# EAGLE design Climber (EAGLE 9.5.2)
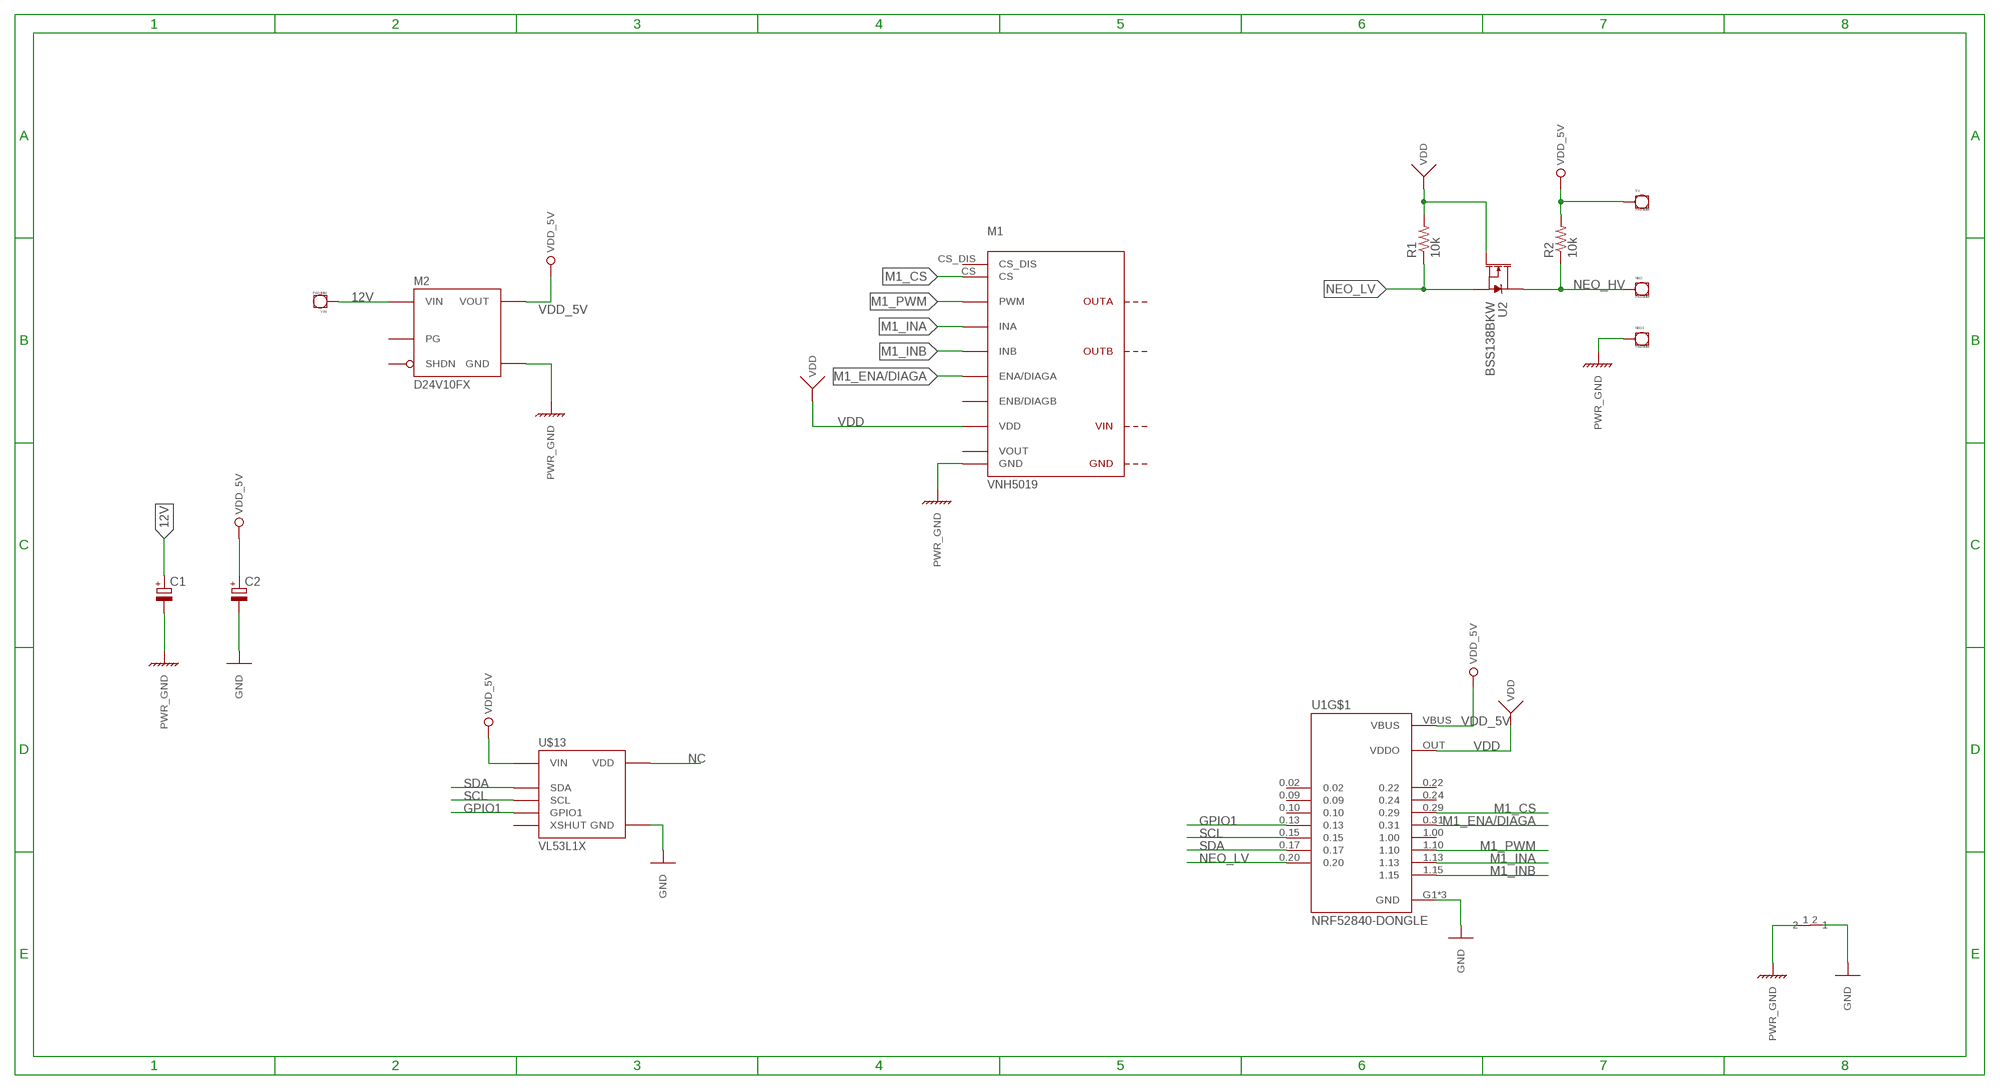
[diagram p0: schematic, sheet 1]

## Parts
5V  PAD3MM  [PAD_3]
C1  CPOL-EUE5-4  [E5-4]
C2  CPOL-EUE5-4  [E5-4]
M1  VNH5019  [VNH5019]
M2  D24V10FX  [D24V10FX]
NEO  PAD3MM  [PAD_3]
NEO1  PAD3MM  [PAD_3]
R1  10k  R-US_R0603  [R0603]
R2  10k  R-US_R0603  [R0603]
U1  NRF52840-DONGLE  [MODULE_NRF52840-DONGLE]
U2  BSS138BKW  [SOT65P210X110-3N]
U$10  NET_CONN  [NET_CONN]
U$13  VL53L1X  [VL53L1X]
VIN  PAD3MM  [PAD_3]

## Nets
12V [Power]: C1.+ M2.VIN VIN.P$1
GND [Power]: C2.- U1.G1(GND) U1.G2(GND) U1.G3(GND) U$10.2 U$13.GND
GPIO1: U1.0.13 U$13.GPIO1
M1_CS: M1.CS U1.0.29
M1_ENA/DIAGA: M1.ENA(ENA/DIAGA) U1.0.31
M1_INA: M1.INA U1.1.13
M1_INB: M1.INB U1.1.15
M1_PWM: M1.PWM U1.1.10
NC: U$13.VDD
NEO_HV: NEO.P$1 R2.1 U2.3(D)
NEO_LV: R1.1 U1.0.20 U2.2(S)
PWR_GND [Power]: C1.- M1.GND@0(GND) M1.GND@1(GND) M2.GND NEO1.P$1 U$10.1 ; supply symbol labelled GNDIN
SCL: U1.0.15 U$13.SCL
SDA: U1.0.17 U$13.SDA
VDD [Power]: M1.VDD R1.2 U1.OUT(VDDO) U2.1(G) ; supply symbol labelled 5V
VDD_5V [Power]: 5V.P$1 C2.+ M2.VOUT R2.2 U1.VBUS U$13.VIN
Unconnected: M1.CS_DIS M1.ENB(ENB/DIAGB) M2.!SHDN(SHDN) M2.PG U1.0.02 U1.0.09 U1.0.10 U1.0.22 U1.0.24 U1.1.00 U1.SWDCLK U1.SWDIO U$13.XSHUT

## Power pins joined to a net without a drawn wire
VOUT: M1.VOUT

## Library data of the parts
5V NEO NEO1 VIN = Exposed_pad:PAD: Thing used to expose a pad
C1 C2 = resistor:CPOL-EU: POLARIZED CAPACITOR, European symbol
M1 = Pololu:VNH5019
M2 = Pololu:D24V10FX
R1 R2 = resistor:R-US_: RESISTOR, American symbol
U1 = NRF52840-DONGLE:NRF52840-DONGLE: NRF52840 Bluetooth-5/Thread/802.15.4/ANT/2.4GHz Multiprotocol SoC USB Development Dongle; AVAILABILITY: Unavailable; DESCRIPTION: - Transceiver; Bluetooth® 5 For Use With nRF52840; MF: Nordic Semiconductor; MP: NRF52840-DONGLE; PACKAGE: None; PRICE: None
U2 = BSS138:BSS138BKW: N-channel Trench MOSFET; MPN: BSS138BKW; OC_FARNELL: 2053836; OC_NEWARK: 61T7488; PACKAGE: SOT-23-3; SUPPLIER: NXP
U$10 = NET_CONN:NET_CONN: Net connector
U$13 = Pololu:VL53L1X

## Net classes
0 default: width 0.203 mm, drill 0.762 mm, clearance 0.203 mm
1 Power: width 0.635 mm, drill 1.27 mm, clearance 0.254 mm to class 0, clearance 0.508 mm

## Board
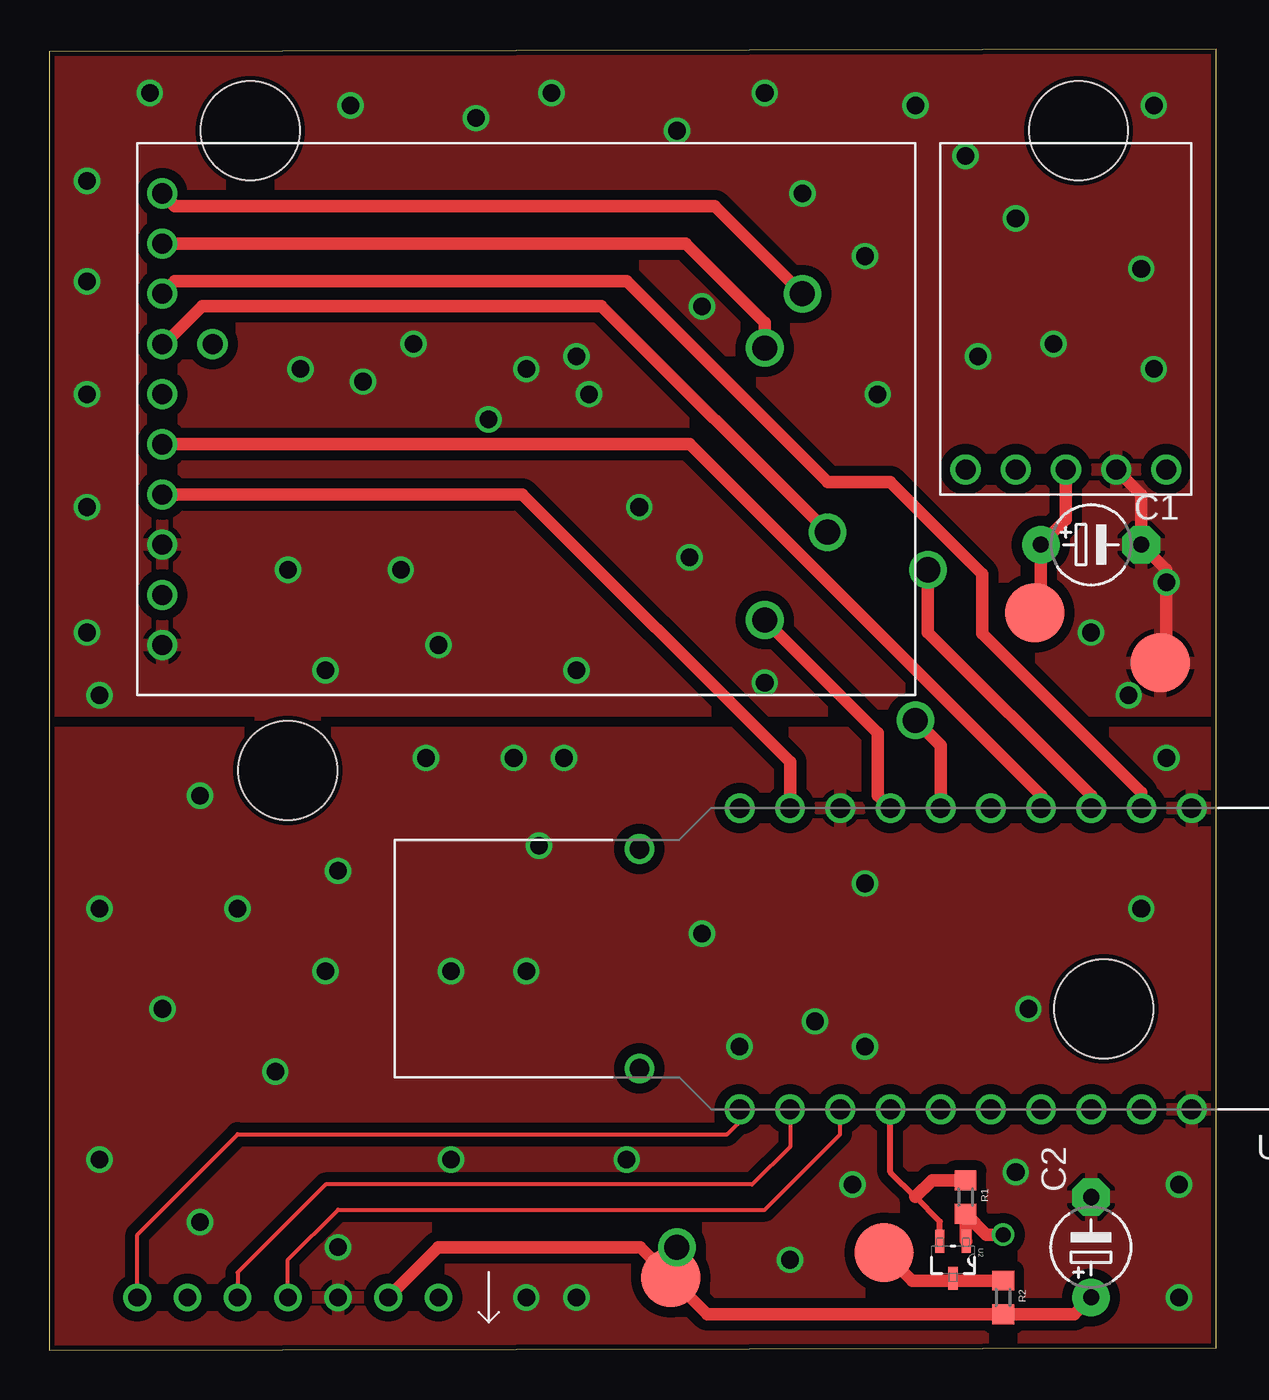
[diagram p1: board, top side]
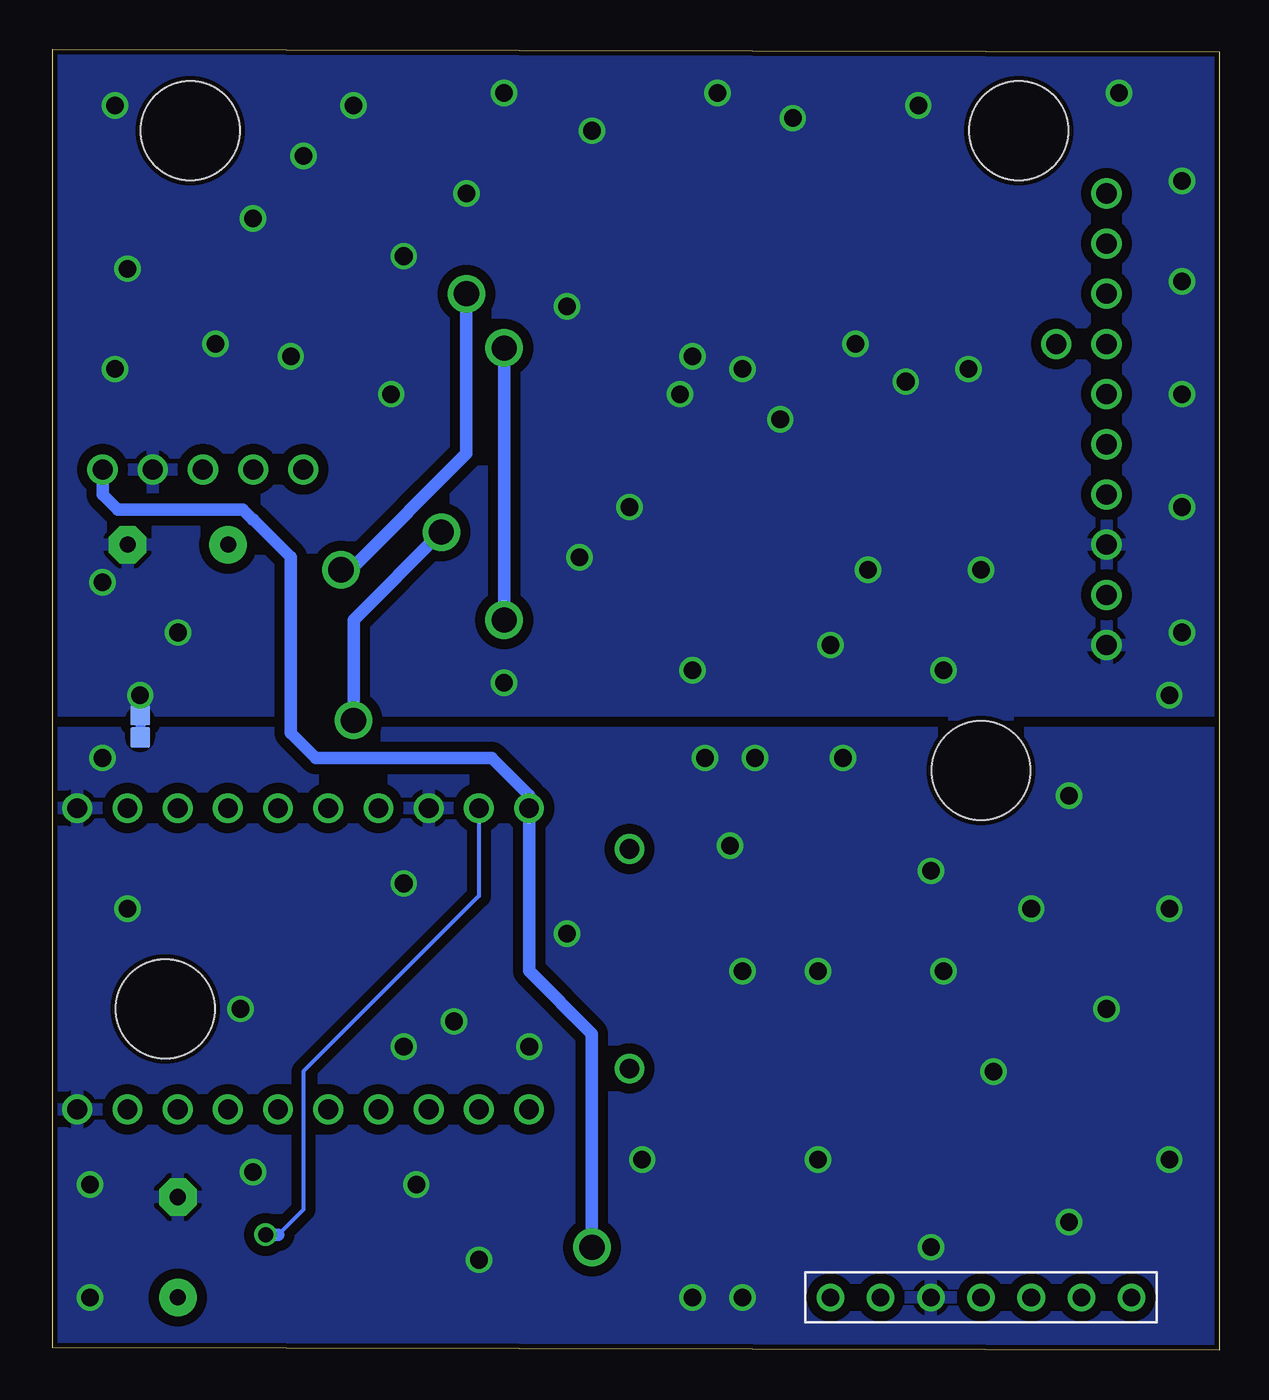
[diagram p2: board, bottom side, seen from below]

Size 59.04 x 65.84 mm. Coordinates in mm from the lower left corner, seen from the top.
Outline: 0,0 59.04,0.13 59.04,65.84 0,65.71 0,0
Copper layers (1*16): Top 0.035mm / dielectric 1.5mm / Bottom 0.035mm
Design rules "SeeedStudio_2layer_DRU_no_angle_20140221": minimum track width 6mil, minimum drill 12mil, track to track 6mil, track to pad 6mil, pad to pad 6mil, via to via 6mil, smd to smd 0mil, copper to edge 10mil, drill to drill 10mil, minimum pad ring 10mil, minimum via ring 6mil, stop-mask expansion 2mil, vias tented up to drill 100mil, thermal gap 10mil
Holes 5 mm at 12.06,29.34 52.07,61.72 10.16,61.72 53.34,17.27

### Footprints (pad centres in the part's own frame; a part is rotated, then mirrored left to right if it is on the bottom)
PAD_3 = smd 3 x 3: P$1 0.325,1
E5-4 = drill 0.813 pad 1.905: + -2.54,0 | drill 0.813 pad 1.905 octagon: - 2.54,0
VNH5019 = drill 1.016: CS 15.24,0; CS_DIS 15.24,-2.54; ENA 20.32,0; ENB 12.7,0; GND@0 5.08,0; GND@1 0,0; INA 22.86,0; INB 10.16,0; PWM 17.78,0; VDD 7.62,0; VOUT 2.54,0
D24V10FX = drill 1.016: !SHDN 7.62,0; GND 2.54,0; PG 10.16,0; VIN 5.08,0; VOUT 0,0
R0603 = smd 1 x 1.1: 1 -0.85,0; 2 0.85,0
MODULE_NRF52840-DONGLE = drill 1: 0.02 10.152,-15.24; 0.09 5.072,0; 0.10 2.532,0; 0.13 22.852,0; 0.15 20.312,0; 0.17 17.772,0; 0.20 15.232,0; 0.22 12.692,0; 0.24 10.152,0; 0.29 12.692,-15.24; 0.31 15.232,-15.24; 1.00 7.612,0; 1.10 2.532,-15.24; 1.13 5.072,-15.24; 1.15 7.612,-15.24; G1 -0.008,0; G2 -0.008,-15.24; G3 17.772,-15.24; OUT 20.312,-15.24; SWDCLK 27.932,-13.18; SWDIO 27.932,-2.06; VBUS 22.852,-15.24
SOT65P210X110-3N = smd 1.168 x 0.457: 1 -0.94,0.66; 2 -0.94,-0.66; 3 0.94,0
NET_CONN = smd 1 x 1: 1 0.381,0; 2 1.5,0
VL53L1X = drill 0.889: GND 0,-5.08; GPIO1 0,-15.24; SCL 0,-10.16; SDA 0,-7.62; VDD 0,0; VIN 0,-2.54; XSHUT 0,-12.7

### Placement (x,y rotation side)
5V  31.11,2.67 0 top
C1  52.71,40.77 0 top
C2  52.71,5.21 90 top
M1  5.71,35.69 90 top
M2  56.52,44.58 180 top
NEO  41.91,3.94 0 top
NEO1  55.88,33.78 0 top
R1  46.36,7.75 270 top
R2  48.26,2.67 270 top
U1  57.79,12.19 180 top
U2  45.72,4.57 270 top
U$10  54.61,32.51 270 bottom
U$13  19.68,2.67 270 top
VIN  49.53,36.32 0 top

### Tracks (layer width: path | path; a pad name or v marks a point on that pad's centre or on a via)
12V
  Top 0.635: M2.VIN 51.44,42.04 C1.+ 50.16,37.63 VIN.P$1
GND  (via drill 0.89)
  other vias: 2.54,22.35 5.71,17.27 14.61,24.26 24.13,19.18 24.76,25.53 33.02,21.08 2.54,9.65 26.67,2.67 20.32,9.65 29.21,9.65 40.64,8.38 14.61,5.21 7.62,6.48 19.05,29.97 23.49,29.97 26.04,29.97 20.32,19.18 13.97,19.18 11.43,14.1 9.53,22.35 56.52,29.97 41.27,23.62 49.53,17.27 55.25,22.35 38.73,16.64 37.47,4.57 24.13,2.67 34.93,15.37 41.27,15.37 57.15,2.67 57.15,8.38 48.9,9.02 7.62,28.07
  pour Bottom: -5.71,26.8 -1.27,31.24 60.96,31.24 63.5,28.7 63.5,-0.51 62.23,-1.78 -3.81,-1.78 -5.71,0.13
  pour Top: -5.08,26.8 -0.64,31.24 61.59,31.24 64.13,28.7 64.13,-0.51 62.87,-1.78 -3.17,-1.78 -5.08,0.13
GPIO1
  Top 0.203: U$13.GPIO1 4.45,5.84 9.53,10.92 34.29,10.92 34.93,11.57 U1.0.13
M1_CS  (via drill 1.27)
  Top 0.635: M1.CS 5.81,50.93 7.72,52.84 27.93,52.84 v39.37,41.4 | U1.0.29 45.09,30.6 v43.82,31.88
  Bottom 0.635: v39.37,41.4 43.82,36.96 v43.82,31.88
M1_ENA/DIAGA  (via drill 1.27)
  Top 0.635: M1.ENA 32.21,56.01 36.2,52.02 v36.2,50.72 | U1.0.31 41.92,28.07 41.92,31.23 v36.2,36.96
  Bottom 0.635: v36.2,50.72 v36.2,36.96
M1_INA  (via drill 1.27)
  Top 0.635: U1.1.13 52.71,28.07 44.45,36.33 v44.45,39.5 | v38.1,53.47 33.66,57.91 6.35,57.91 M1.INA
  Bottom 0.635: v44.45,39.5 43.97,39.5 38.1,45.37 v38.1,53.47
M1_INB
  Top 0.635: M1.INB 32.39,45.85 50.17,28.07 U1.1.15
M1_PWM
  Top 0.635: M1.PWM 6.35,54.1 29.21,54.1 39.37,43.94 42.55,43.94 47.19,39.29 47.19,36.27 55.25,28.21 U1.1.10
NEO_HV
  Top 0.635: R2.1 45.84,3.52 | 45.84,3.52 U2.3 | NEO.P$1 43.66,3.52 45.84,3.52
NEO_LV
  Top 0.305: U2.2 45.06,6.5 43.82,7.75 42.55,9.01 U1.0.20
  Top 0.635: R1.1 44.66,8.6 43.82,7.75
PWR_GND  (via drill 0.89)
  Top 0.635: M2.GND 55.25,43.31 C1.- 56.52,39.5 v56.52,38.86 56.52,35.09 NEO1.P$1
  Bottom 0.635: U$10.1 v54.61,33.15
  other vias: 55.25,54.74 48.9,57.28 55.88,49.66 50.8,50.93 38.1,58.55 41.91,48.39 32.39,40.13 36.2,33.78 18.41,50.93 22.22,47.12 24.13,49.66 27.3,48.39 43.82,62.99 5.08,63.63 1.91,59.18 1.91,54.1 1.91,48.39 1.91,42.67 15.24,62.99 21.59,62.36 25.4,63.63 31.75,61.72 36.2,63.63 46.36,60.45 55.88,62.99 46.99,50.29 52.71,36.32 26.67,50.29 41.27,55.37 29.84,42.67 17.78,39.5 19.68,35.69 12.06,39.5 13.97,34.42 1.91,36.32 2.54,33.15 12.7,49.66 26.67,34.42 15.88,49.02 33.02,52.83
  pour Bottom (rank 2): -4.45,68.71 64.13,68.71 66.67,66.17 66.67,-1.14 64.13,-3.68 -4.45,-3.68 -6.98,-1.14 -6.98,66.17
  pour Top (rank 2): -1.91,67.44 66.67,67.44 69.21,64.9 69.21,-2.41 66.67,-4.95 -1.91,-4.95 -4.45,-2.41 -4.45,64.9
SCL
  Top 0.203: U1.0.15 37.47,10.3 35.56,8.38 13.97,8.38 9.53,3.94 U$13.SCL
SDA
  Top 0.203: U$13.SDA 12.06,4.57 14.61,7.11 36.2,7.11 40.01,10.93 U1.0.17
VDD  (via drill 0.76)
  Top 0.635: U2.1 46.36,5.54 R1.2 47.41,5.84 v48.26,5.84 | U1.OUT 37.47,29.76 23.92,43.31 M1.VDD
  Bottom 0.203: U1.OUT 37.47,22.98 46.36,14.1 46.36,7.11 47.62,5.84
  Bottom 0.635: 47.62,5.84 v48.26,5.84
VDD_5V  (via drill 1.27)
  Top 0.635: 5V.P$1 29.9,5.21 19.68,5.21 U$13.VIN | C2.+ 51.86,1.82 R2.2 33.29,1.82 5V.P$1 | 5V.P$1 31.44,4.9 v31.75,5.21
  Bottom 0.635: v31.75,5.21 31.75,16 34.93,19.19 U1.VBUS 34.93,27.44 34.93,28.07 36.83,29.97 45.72,29.97 46.99,31.24 46.99,40.13 48.9,42.04 48.92,42.04 49.43,42.55 55.75,42.55 56.52,43.31 M2.VOUT